# EAGLE schematic finger_circuit (EAGLE 9.5.1)
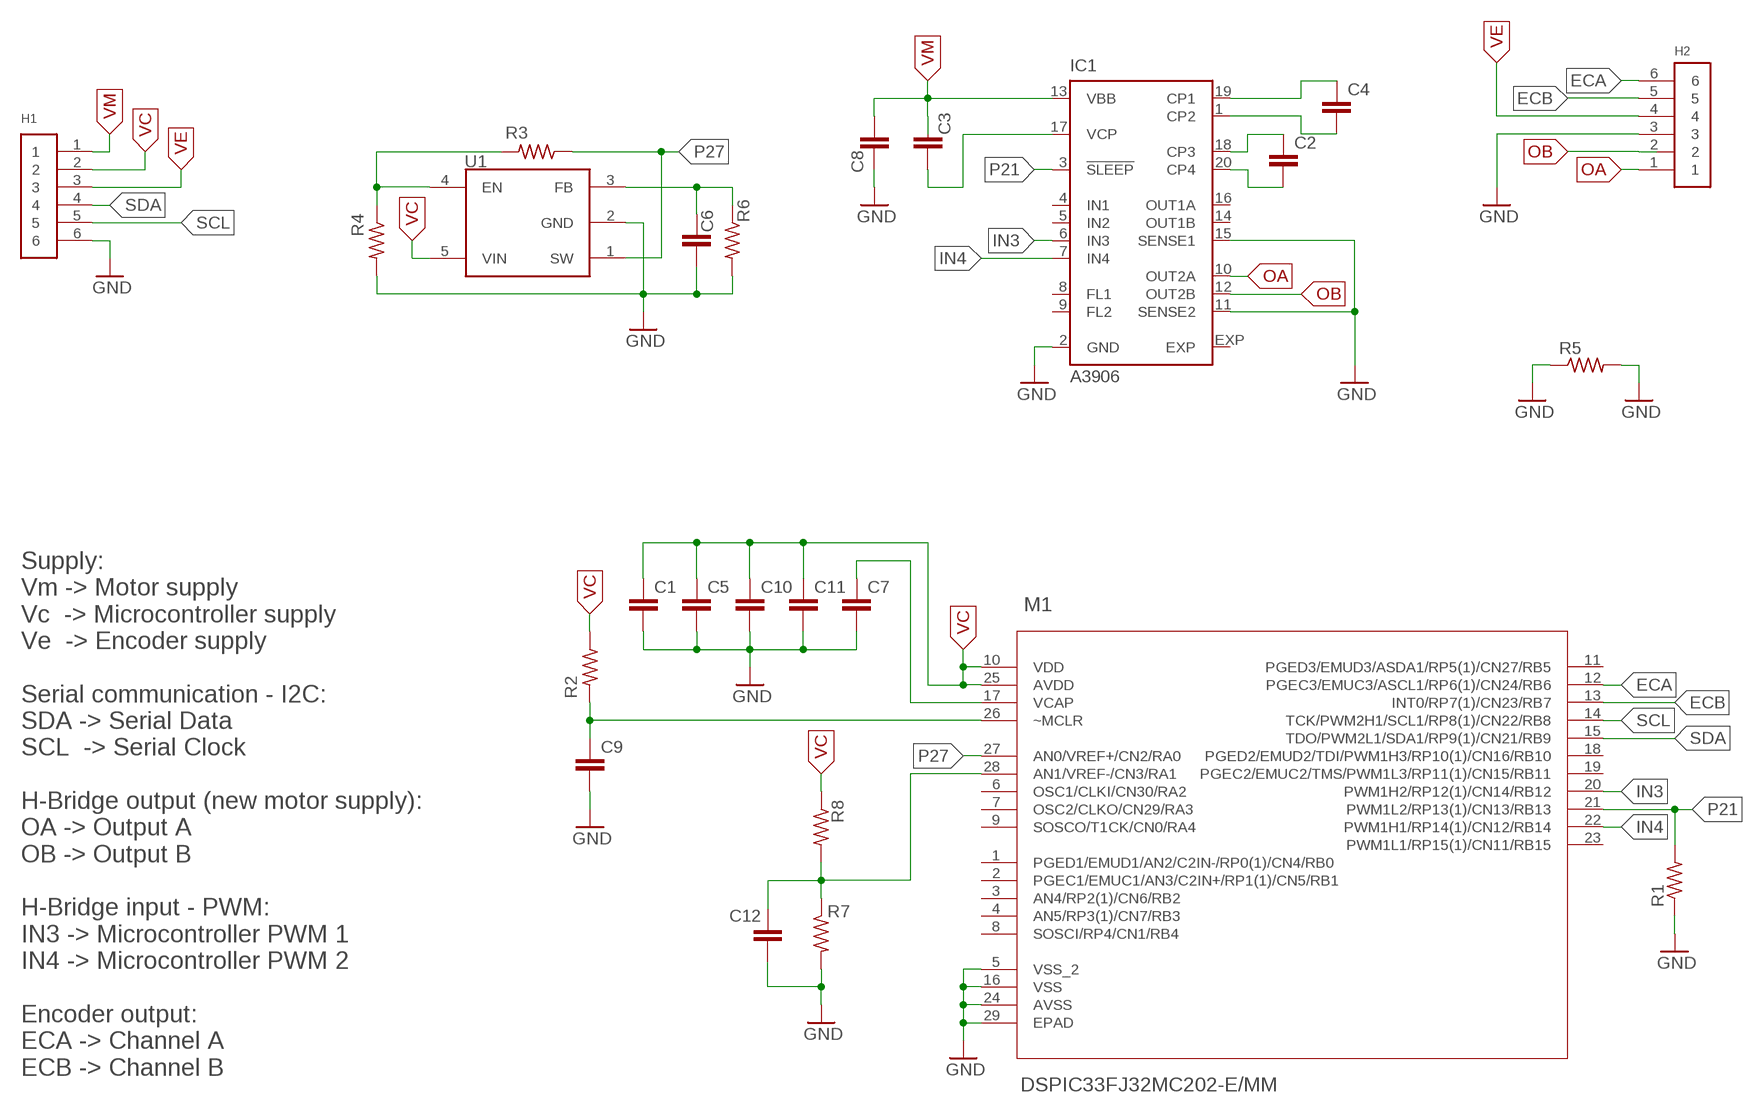
[diagram p0: schematic, sheet 1]

## Parts
C1  CAPACITOR_0805_M  [RESC0805_M]
C2  CAPACITOR_0805_M  [RESC0805_M]
C3  CAPACITOR_0805_M  [RESC0805_M]
C4  CAPACITOR_0805_M  [RESC0805_M]
C5  CAPACITOR_0805_M  [RESC0805_M]
C6  CAPACITOR_0805_M  [RESC0805_M]
C7  CAPACITOR_0805_M  [RESC0805_M]
C8  CAPACITOR_0805_M  [RESC0805_M]
C9  CAPACITOR_0805_M  [RESC0805_M]
C10  CAPACITOR_0805_M  [RESC0805_M]
C11  CAPACITOR_0805_M  [RESC0805_M]
C12  CAPACITOR_0805_M  [RESC0805_M]
H1  61300611121  [61300611121]
H2  61300611121  [61300611121]
IC1  A3906  [QFN20]
M1  DSPIC33FJ32MC202-E/MM  [QFN65P600X600X100-29N]
R1  R-US_R0805  [R0805]
R2  R-US_R0805  [R0805]
R3  R-US_R0805  [R0805]
R4  R-US_R0805  [R0805]
R5  R-US_R0805  [R0805]
R6  R-US_R0805  [R0805]
R7  R-US_R0805  [R0805]
R8  R-US_R0805  [R0805]
U1  LMR10510  LMR10510YMFE/NOPB  [SOT-23-5]

## Nets
ECA: H2.6 M1.12(PGEC3/EMUC3/ASCL1/RP6(1)/CN24/RB6)
ECB: H2.5 M1.13(INT0/RP7(1)/CN23/RB7)
GND: C1.2 C5.2 C6.2 C7.2 C8.1 C9.2 C10.2 C11.2 C12.2 H1.6 H2.3 IC1.2(GND) IC1.11(SENSE2) IC1.15(SENSE1) M1.5(VSS_2) M1.16(VSS) M1.24(AVSS) M1.29(EPAD) R1.1 R4.2 R5.1 R5.2 R6.2 R7.2 U1.2(GND)
IN3: IC1.6(IN3) M1.20(PWM1H2/RP12(1)/CN14/RB12)
IN4: IC1.7(IN4) M1.22(PWM1H1/RP14(1)/CN12/RB14)
N$1: C12.1 M1.28(AN1/VREF-/CN3/RA1) R7.1 R8.2
N$2: R3.2 R4.1 U1.4(EN)
N$3: C9.1 M1.26(~MCLR) R2.2
N$4: C6.1 R6.1 U1.3(FB)
N$5: C3.2 IC1.17(VCP)
N$11: C7.1 M1.17(VCAP)
N$12: C4.2 IC1.1(CP2)
N$22: C2.1 IC1.18(CP3)
N$23: C2.2 IC1.20(CP4)
N$24: C4.1 IC1.19(CP1)
OA: H2.1 IC1.10(OUT2A)
OB: H2.2 IC1.12(OUT2B)
P21: IC1.3(!SLEEP) M1.21(PWM1L2/RP13(1)/CN13/RB13) R1.2
P27: M1.27(AN0/VREF+/CN2/RA0) R3.1 U1.1(SW)
SCL: H1.5 M1.14(TCK/PWM2H1/SCL1/RP8(1)/CN22/RB8)
SDA: H1.4 M1.15(TDO/PWM2L1/SDA1/RP9(1)/CN21/RB9)
VC: C1.1 C5.1 C10.1 C11.1 H1.2 M1.10(VDD) M1.25(AVDD) R2.1 R8.1 U1.5(VIN)
VE: H1.3 H2.4
VM: C3.1 C8.2 H1.1 IC1.13(VBB)
Unconnected: IC1.4(IN1) IC1.5(IN2) IC1.8(FL1) IC1.9(FL2) IC1.14(OUT1B) IC1.16(OUT1A) IC1.EXP M1.1(PGED1/EMUD1/AN2/C2IN-/RP0(1)/CN4/RB0) M1.2(PGEC1/EMUC1/AN3/C2IN+/RP1(1)/CN5/RB1) M1.3(AN4/RP2(1)/CN6/RB2) M1.4(AN5/RP3(1)/CN7/RB3) M1.6(OSC1/CLKI/CN30/RA2) M1.7(OSC2/CLKO/CN29/RA3) M1.8(SOSCI/RP4/CN1/RB4) M1.9(SOSCO/T1CK/CN0/RA4) M1.11(PGED3/EMUD3/ASDA1/RP5(1)/CN27/RB5) M1.18(PGED2/EMUD2/TDI/PWM1H3/RP10(1)/CN16/RB10) M1.19(PGEC2/EMUC2/TMS/PWM1L3/RP11(1)/CN15/RB11) M1.23(PWM1L1/RP15(1)/CN11/RB15)

## Notes on the sheet
- Supply:
  Vm -> Motor supply
  Vc  -> Microcontroller supply
  Ve  -> Encoder supply
  
  Serial communication - I2C:
  SDA -> Serial Data
  SCL  -> Serial Clock
  
  H-Bridge output (new motor supply):
  OA -> Output A
  OB -> Output B
  
  H-Bridge input - PWM:
  IN3 -> Microcontroller PWM 1
  IN4 -> Microcontroller PWM 2
  
  Encoder output:
  ECA -> Channel A 
  ECB -> Channel B

## Library data of the parts
C1-C12 = Nordic_nRF:CAPACITOR: Generic chip capacitor
H1 H2 = Headers:61300611121: CONN HEADER VERT 6POS 2.54MM Manufacturer's datasheet <https://katalog.we-online.de/em/datasheet/6130xx11121.pdf>; CREATED_BY: PCBLayout.com; DIGI_KEY_PART_NUMBER: 732-5319-ND; MANUFACTURER: Wurth Electronics Inc.; MPN: 61300611121
IC1 = allegro:A3906: Low Voltage Stepper and Single/Dual DC Motor Driver Data Sheet <http://www.allegromicro.com/en/Products/Part_Numbers/3906/3906.pdf>
M1 = DSPIC33FJ32MC202-E_MM:DSPIC33FJ32MC202-E/MM: 16-bit Digital Signal Controllers; DESCRIPTION: dsPIC Automotive, AEC-Q100, dsPIC™ 33F Microcontroller IC 16-Bit 40 MIPs 32KB _32K x 8_ FLASH 28-QFN-S _6x6_; DIGI-KEY_PART_NUMBER: DSPIC33FJ32MC202-E/MM-ND; DIGI-KEY_PURCHASE_URL: https://www.digikey.com/product-detail/en/microchip-technology/DSPIC33FJ32MC202-E-MM/DSPIC33FJ32MC202-E-MM-ND/1635835?utm_source=snapeda&utm_medium=aggregator&utm_campaign=symbol; MF: Microchip; MP: DSPIC33FJ32MC202-E/MM; PACKAGE: QFN-28 Microchip
R1-R8 = BeagleBone_Black_Wireless:R-US_: RESISTOR, American symbol
U1 = IC:LMR10510YMFE/NOPB: IC REG BUCK ADJ 1A SOT23-5 Manufacturer's datasheet <http://www.ti.com/general/docs/suppproductinfo.tsp?distId=10&gotoUrl=http%3A%2F%2Fwww.ti.com%2Flit%2Fgpn%2Flmr10510>; CREATED_BY: PCBLayout.com; DIGIKEY_PART_NUMBER: LMR10510YMFE/NOPBTR-ND; MANUFACTURER: Texas Instruments; MPN: LMR10510YMFE/NOPB; PACKAGE: SOT23-5